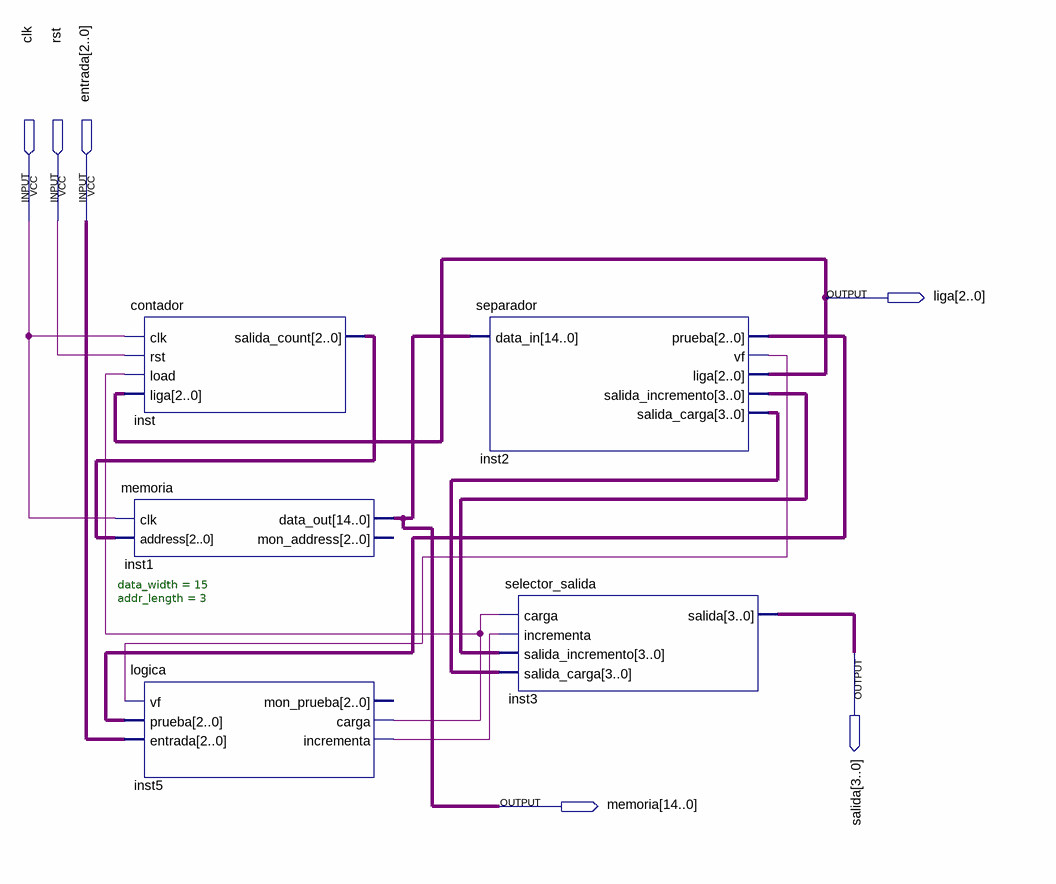
[diagram p0: schematic sheet]
// Quartus schematic practica_5.bdf as structural Verilog: 5 symbols, 6 pins
module practica_5 (
  input  clk,
  input  rst,
  input  [2:0] entrada,
  output [2:0] liga,
  output [3:0] salida,
  output [14:0] memoria
);

  wire inst2_vf, inst5_carga, inst5_incrementa;
  wire [2:0] inst2_prueba, inst_salida_count;
  wire [3:0] inst2_salida_carga, inst2_salida_incremento;

  contador inst (.clk(clk), .rst(rst), .load(inst5_carga), .liga(liga), .salida_count(inst_salida_count));
  memoria #(.data_width(15), .addr_length(3)) inst1 (
    .clk(clk), .address(inst_salida_count), .data_out(memoria));  // open: mon_address
  logica inst5 (
    .vf(inst2_vf), .prueba(inst2_prueba), .entrada(entrada), .carga(inst5_carga),
    .incrementa(inst5_incrementa));  // open: mon_prueba
  separador inst2 (
    .data_in(memoria), .prueba(inst2_prueba), .vf(inst2_vf), .liga(liga),
    .salida_incremento(inst2_salida_incremento), .salida_carga(inst2_salida_carga));
  selector_salida inst3 (
    .carga(inst5_carga), .incrementa(inst5_incrementa), .salida_incremento(inst2_salida_incremento),
    .salida_carga(inst2_salida_carga), .salida(salida));
endmodule
